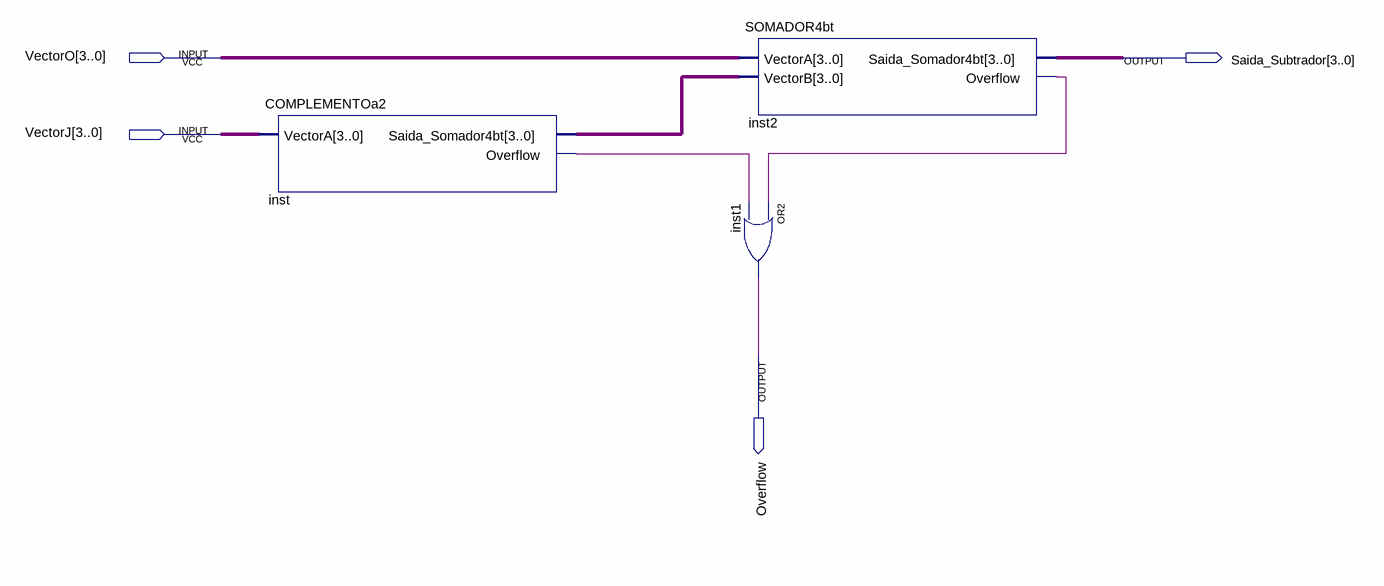
[diagram p0: schematic sheet]
// Quartus schematic SUBTRATOR4bt.bdf as structural Verilog: 3 symbols, 4 pins
module SUBTRATOR4bt (
  input  [3:0] VectorO,
  input  [3:0] VectorJ,
  output [3:0] Saida_Subtrador,
  output Overflow
);

  wire inst2_overflow, inst_overflow;
  wire [3:0] inst_saida_somador4bt;

  COMPLEMENTOa2 inst (.VectorA(VectorJ), .Saida_Somador4bt(inst_saida_somador4bt), .Overflow(inst_overflow));
  SOMADOR4bt inst2 (
    .VectorA(VectorO), .VectorB(inst_saida_somador4bt), .Saida_Somador4bt(Saida_Subtrador),
    .Overflow(inst2_overflow));
  or inst1 (Overflow, inst2_overflow, inst_overflow);
endmodule
